# Altium schematic sheet ZigBee_CC2420RTC.SchDoc: IEEE 802.15.4 (ZigBee) Circuit
size A3; Organization: Altium Limited; Address1: L3, 12a Rodborough Rd; Address2: Frenchs Forest; Address3: NSW; Address4: Australia 2086; SheetNumber: 1; SheetTotal: 100; PageSetup: Record=PageOptions|CenterHorizontal=True|CenterVertical=True|PrintScale=0.97|XCorrection=1.00|YCorrection=1.00|PrintKind=1|BorderSize=5000000|LeftOffset=0|BottomOffset=0|Orientation=2|PaperLength=1000|PaperWidth=1000|Scale=100|PaperSource=7|PrintQuality=-4|MediaType=1|DitherType=10|PaperKind=A4|PrintScaleMode=1
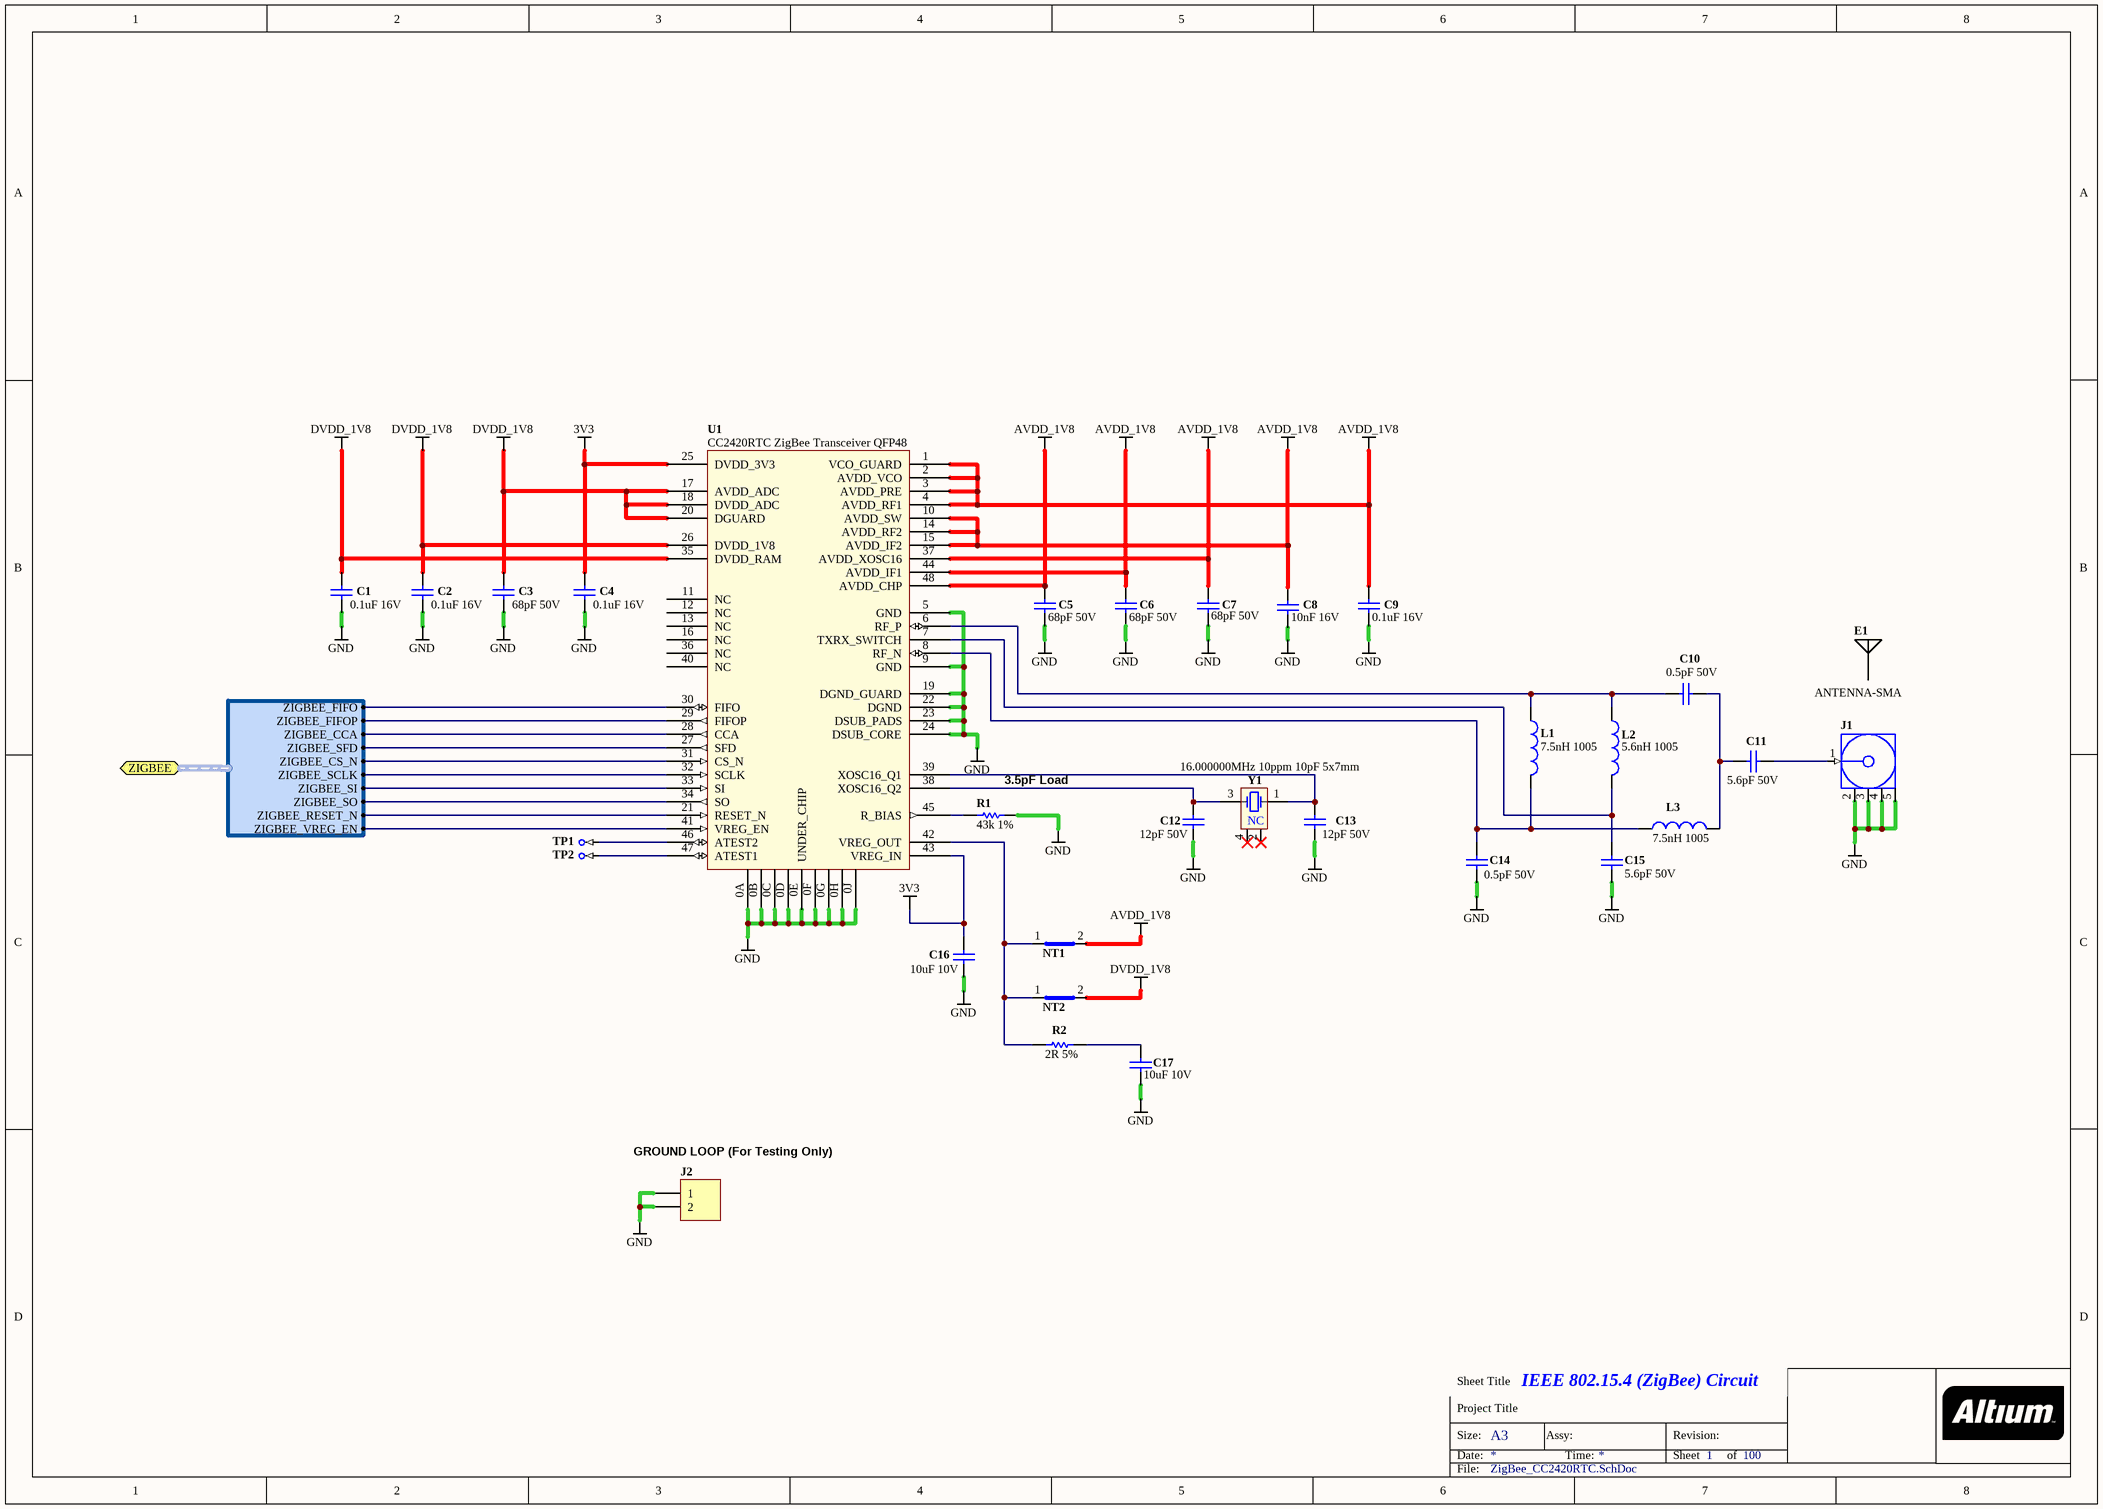
[diagram p0: ZigBee_CC2420RTC.SchDoc]

## Parts
C1  0.1uF 16V  [CAPC1005-STAR]
C2  0.1uF 16V  [CAPC1005-STAR]
C3  68pF 50V  [CAPC1005-STAR]
C4  0.1uF 16V  [CAPC1005-STAR]
C5  68pF 50V  [CAPC1005-STAR]
C6  68pF 50V  [CAPC1005-STAR]
C7  68pF 50V  [CAPC1005-STAR]
C8  10nF 16V  [CAPC1005-STAR]
C9  0.1uF 16V  [CAPC1005-STAR]
C10  0.5pF 50V  [CAPC1005-STAR]
C11  5.6pF 50V  [CAPC1005-STAR]
C12  12pF 50V  [CAPC1005-STAR]
C13  12pF 50V  [CAPC1005-STAR]
C14  0.5pF 50V  [CAPC1005-STAR]
C15  5.6pF 50V  [CAPC1005-STAR]
C16  10uF 10V  [CAPC3216-STAR]
C17  10uF 10V  [CAPC3216-STAR]
E1  ANTENNA-SMA
J1  SMA 5-pin Vertical Jack 50R  [HDR-SMA-THD-5-PIN]  (value not drawn)
J2  1x2 HEADER MALE  [HDR1X2]  (value not drawn)  (no BOM)
L1  7.5nH 1005  [INDC1005]
L2  5.6nH 1005  [INDC1005]
L3  7.5nH 1005  [INDC1005]
NT1  Net Tie SMT2  [NETTIE-SMT2-16X11]  (value not drawn)  (net tie, no BOM)
NT2  Net Tie SMT2  [NETTIE-SMT2-16X11]  (value not drawn)  (net tie, no BOM)
R1  43k 1%  [RESC1005-STAR]
R2  2R 5%  [RESC1005-STAR]
TP1  TestPin  [TestPin]  (value not drawn)  (no BOM)
TP2  TestPin  [TestPin]  (value not drawn)  (no BOM)
U1  CC2420RTC ZigBee Transceiver QFP48  [SQFP50P700X700-48]
Y1  16.000000MHz 10ppm 10pF 5x7mm  [XTAL-7X5]

## Ports
ZIGBEE (harness ZIGBEE)

## Harnesses
ZIGBEE: ZIGBEE_FIFO, ZIGBEE_FIFOP, ZIGBEE_CCA, ZIGBEE_SFD, ZIGBEE_CS_N, ZIGBEE_SCLK, ZIGBEE_SI, ZIGBEE_SO, ZIGBEE_RESET_N, ZIGBEE_VREG_EN

## Nets
3V3: C4.1 C16.1 U1.25(DVDD_3V3) U1.43(VREG_IN)
AVDD_1V8: C5.1 C6.1 C7.1 C8.1 C9.1 NT1.2(Net2) U1.1(VCO_GUARD) U1.2(AVDD_VCO) U1.3(AVDD_PRE) U1.4(AVDD_RF1) U1.10(AVDD_SW) U1.14(AVDD_RF2) U1.15(AVDD_IF2) U1.37(AVDD_XOSC16) U1.44(AVDD_IF1) U1.48(AVDD_CHP)
DVDD_1V8: C1.1 C2.1 C3.1 NT2.2(Net2) U1.17(AVDD_ADC) U1.18(DVDD_ADC) U1.20(DGUARD) U1.26(DVDD_1V8) U1.35(DVDD_RAM)
GND: C1.2 C2.2 C3.2 C4.2 C5.2 C6.2 C7.2 C8.2 C9.2 C12.1 C13.1 C14.1 C15.2 C16.2 C17.2 J1.2(GND) J1.3(GND) J1.4(GND) J1.5(GND) J2.1 J2.2 R1.2 U1.0A U1.0B U1.0C U1.0D U1.0E(UNDER_CHIP) U1.0F U1.0G U1.0H U1.0J U1.5(GND) U1.9(GND) U1.19(DGND_GUARD) U1.22(DGND) U1.23(DSUB_PADS) U1.24(DSUB_CORE)
NetC10_1: C10.1 L1.1 L2.1 U1.6(RF_P)
NetC10_2: C10.2 C11.1 L3.2
NetC11_2: C11.2 J1.1(Signal)
NetC12_2: C12.2 U1.38(XOSC16_Q2) Y1.3(X2)
NetC13_2: C13.2 U1.39(XOSC16_Q1) Y1.1(X1)
NetC14_2: C14.2 L1.2 L3.1 U1.8(RF_N)
NetC15_1: C15.1 L2.2 U1.7(TXRX_SWITCH)
NetC17_1: C17.1 R2.2
NetNT1_1: NT1.1(Net1) NT2.1(Net1) R2.1 U1.42(VREG_OUT)
NetR1_1: R1.1 U1.45(R_BIAS)
NetTP1_1: TP1.1 U1.46(ATEST2)
NetTP2_1: TP2.1 U1.47(ATEST1)
NetU1_21: U1.21(RESET_N) ; port ZIGBEE.ZIGBEE_RESET_N
NetU1_27: U1.27(SFD) ; port ZIGBEE.ZIGBEE_SFD
NetU1_28: U1.28(CCA) ; port ZIGBEE.ZIGBEE_CCA
NetU1_29: U1.29(FIFOP) ; port ZIGBEE.ZIGBEE_FIFOP
NetU1_30: U1.30(FIFO) ; port ZIGBEE.ZIGBEE_FIFO
NetU1_31: U1.31(CS_N) ; port ZIGBEE.ZIGBEE_CS_N
NetU1_32: U1.32(SCLK) ; port ZIGBEE.ZIGBEE_SCLK
NetU1_33: U1.33(SI) ; port ZIGBEE.ZIGBEE_SI
NetU1_34: U1.34(SO) ; port ZIGBEE.ZIGBEE_SO
NetU1_41: U1.41(VREG_EN) ; port ZIGBEE.ZIGBEE_VREG_EN

Not connected (* = marked no-connect by the designer): U1 11(NC) 12(NC) 13(NC) 16(NC) 36(NC) 40(NC); Y1 2(NC)* 4(NC)*

## Notes on the sheet
- (near R1) 3.5pF Load
- (near J2) GROUND LOOP (For Testing Only)
- Sheet Title
- Project Title
- Size:
- Date:
- A3
- Assy:
- Time:
- Revision:
- Sheet
- of
- File:

## Library data of the parts
C1 C2 C4 C9 = D-101-0080: Capacitor, Ceramic, 0.1uF 10% 16V 0402 (1005) X7R; Polarity: Non-Polarized; Capacitance: 0.1 uF; Dielectric: X7R; Mounting Technology: Surface Mount; Rated Voltage: 16 V; Status: Production; Technology: Ceramic; Tolerance: 10 %; Category: Capacitor
C3 C5-C7 = D-101-0061: Capacitor, Ceramic, 68pF 5% 50V 0402 (1005) COG; Polarity: Non-Polarized; Capacitance: 68 pF; Dielectric: COG; Mounting Technology: Surface Mount; Rated Voltage: 50 V; Status: Unreleased; Technology: Ceramic; Tolerance: 5 %; Category: Capacitor
C8 = D-101-0077: Capacitor, Ceramic, 10nF 10% 16V 0402 (1005) X7R; Polarity: Non-Polarized; Capacitance: 10 nF; Dielectric: X7R; Mounting Technology: Surface Mount; Rated Voltage: 16 V; Status: Production; Technology: Ceramic; Tolerance: 10 %; Category: Capacitor
C10 C14 = D-101-0052: Capacitor, Ceramic, 0.5pF 50V 0402 (1005) COG; Polarity: Non-Polarized; Tolerance: 20 %; Capacitance: 0.5 pF; Dielectric: COG; Mounting Technology: Surface Mount; Rated Voltage: 50 V; Status: Unreleased; Technology: Ceramic; Category: Capacitor
C11 C15 = D-101-0055: Capacitor, Ceramic, 5.6pF 5% 50V 0402 (1005) COG; Polarity: Non-Polarized; Capacitance: 5.6 pF; Dielectric: COG; Mounting Technology: Surface Mount; Rated Voltage: 50 V; Status: Unreleased; Technology: Ceramic; Tolerance: 5 %; Category: Capacitor
C12 C13 = D-101-0058: Capacitor, Ceramic, 12pF 2% 50V 0402 (1005) COG; Polarity: Non-Polarized; Capacitance: 12 pF; Dielectric: COG; Mounting Technology: Surface Mount; Rated Voltage: 50 V; Status: Unreleased; Technology: Ceramic; Tolerance: 2 %; Category: Capacitor
C16 C17 = D-101-0057: Capacitor, Ceramic, 10uF 10% 10V 1206 (3216) X5R; Polarity: Non-Polarized; Capacitance: 10 uF; Dielectric: X5R; Mounting Technology: Surface Mount; Rated Voltage: 10 V; Status: Unreleased; Technology: Ceramic; Tolerance: 10 %; Category: Capacitor
E1 = D-305-0000: Antenna, 2.45GHz 1/4 Wave 50R SMA Antenna; Impedence: 50 Ohms; Status: Unreleased; Category: Antenna; Nominal Fequency: 2.45 GHz
J1 = D-300-0035: SMA RF Coaxial PCB Connector, 5-pin Through-hole, Vertical Mount Socket, 50 ohm impedance; Connector type: Straight; Max Current: mA; Mounting Technology: Through-Hole; Pin Count: 5; Status: Unreleased; Category: Connector
J2 = D-300-0020: Header IDC, 2 x 1 Pin Vertical 2.54mm Pitch (Non-Boxed, Male); Max Current: 3 A; Connector type: Header; Mounting Technology: Through-Hole; Pin Count: 2; Status: Production; Category: Connector
L1 L3 = D-102-0010: Inductor, Chip 7.5nH 300mA DCR=0.24 ohm, High Frequency 0402 (1005); Inductance: 7.5 nH; Max Input Current: 300 mA; Mounting Technology: Surface Mount; Status: Unreleased; Category: Inductor
L2 = D-102-0009: Inductor, Chip 5.6nH 300mA DCR=0.2 ohm, High Frequency 0402 (1005); Inductance: 5.6 nH; Max Input Current: 300 mA; Mounting Technology: Surface Mount; Status: Unreleased; Category: Inductor
NT1 NT2 = D-002-0006: Net-Tie, Surface Mount, 2 x 0.8mm x 0.4mm SMT Pads - For 0.4mm Track; Status: Production; Category: Net-Tie
R1 = D-100-0070: Resistor, 43k 1% 0402 (1005); Power Rating: 63 mW; Mounting Technology: Surface Mount; Resistance: 43 K; Status: Unreleased; Tolerance: 1 %; Category: Resistor
R2 = D-100-0067: Resistopr, 2R 5% 0402 (1005); Power Rating: 63 mW; Mounting Technology: Surface Mount; Resistance: 2 R; Status: Unreleased; Tolerance: 5 %; Category: Resistor
TP1 TP2 = D-006-0000: Test Point, PCB Mount with Silkscreen Box; Status: Production; Category: Test-Point
U1 = D-221-0005: CC2420RTC, 2.45GHz IEEE 802.15.4 (Zigbee) RF Transceiver QFP48; Comm Standard: Zigbee; Mounting Technology: Surface Mount; Status: Unreleased; Category: IC-Communication
Y1 = D-103-0019: Crystal, 16.000000MHz, 5x7mm, 10ppm 10ppm 10pF; Nominal Fequency: 16 MHz; Nominal Operational Voltage: mV; Frequency Stability: 10 ppm; Frequency Tolerance: 10 ppm; Load Capacitance: 10 pF; Mounting Technology: Surface Mount; Status: Unreleased; Category: Crystal